# EAGLE design GimmeSoul (EAGLE 9.5.1)
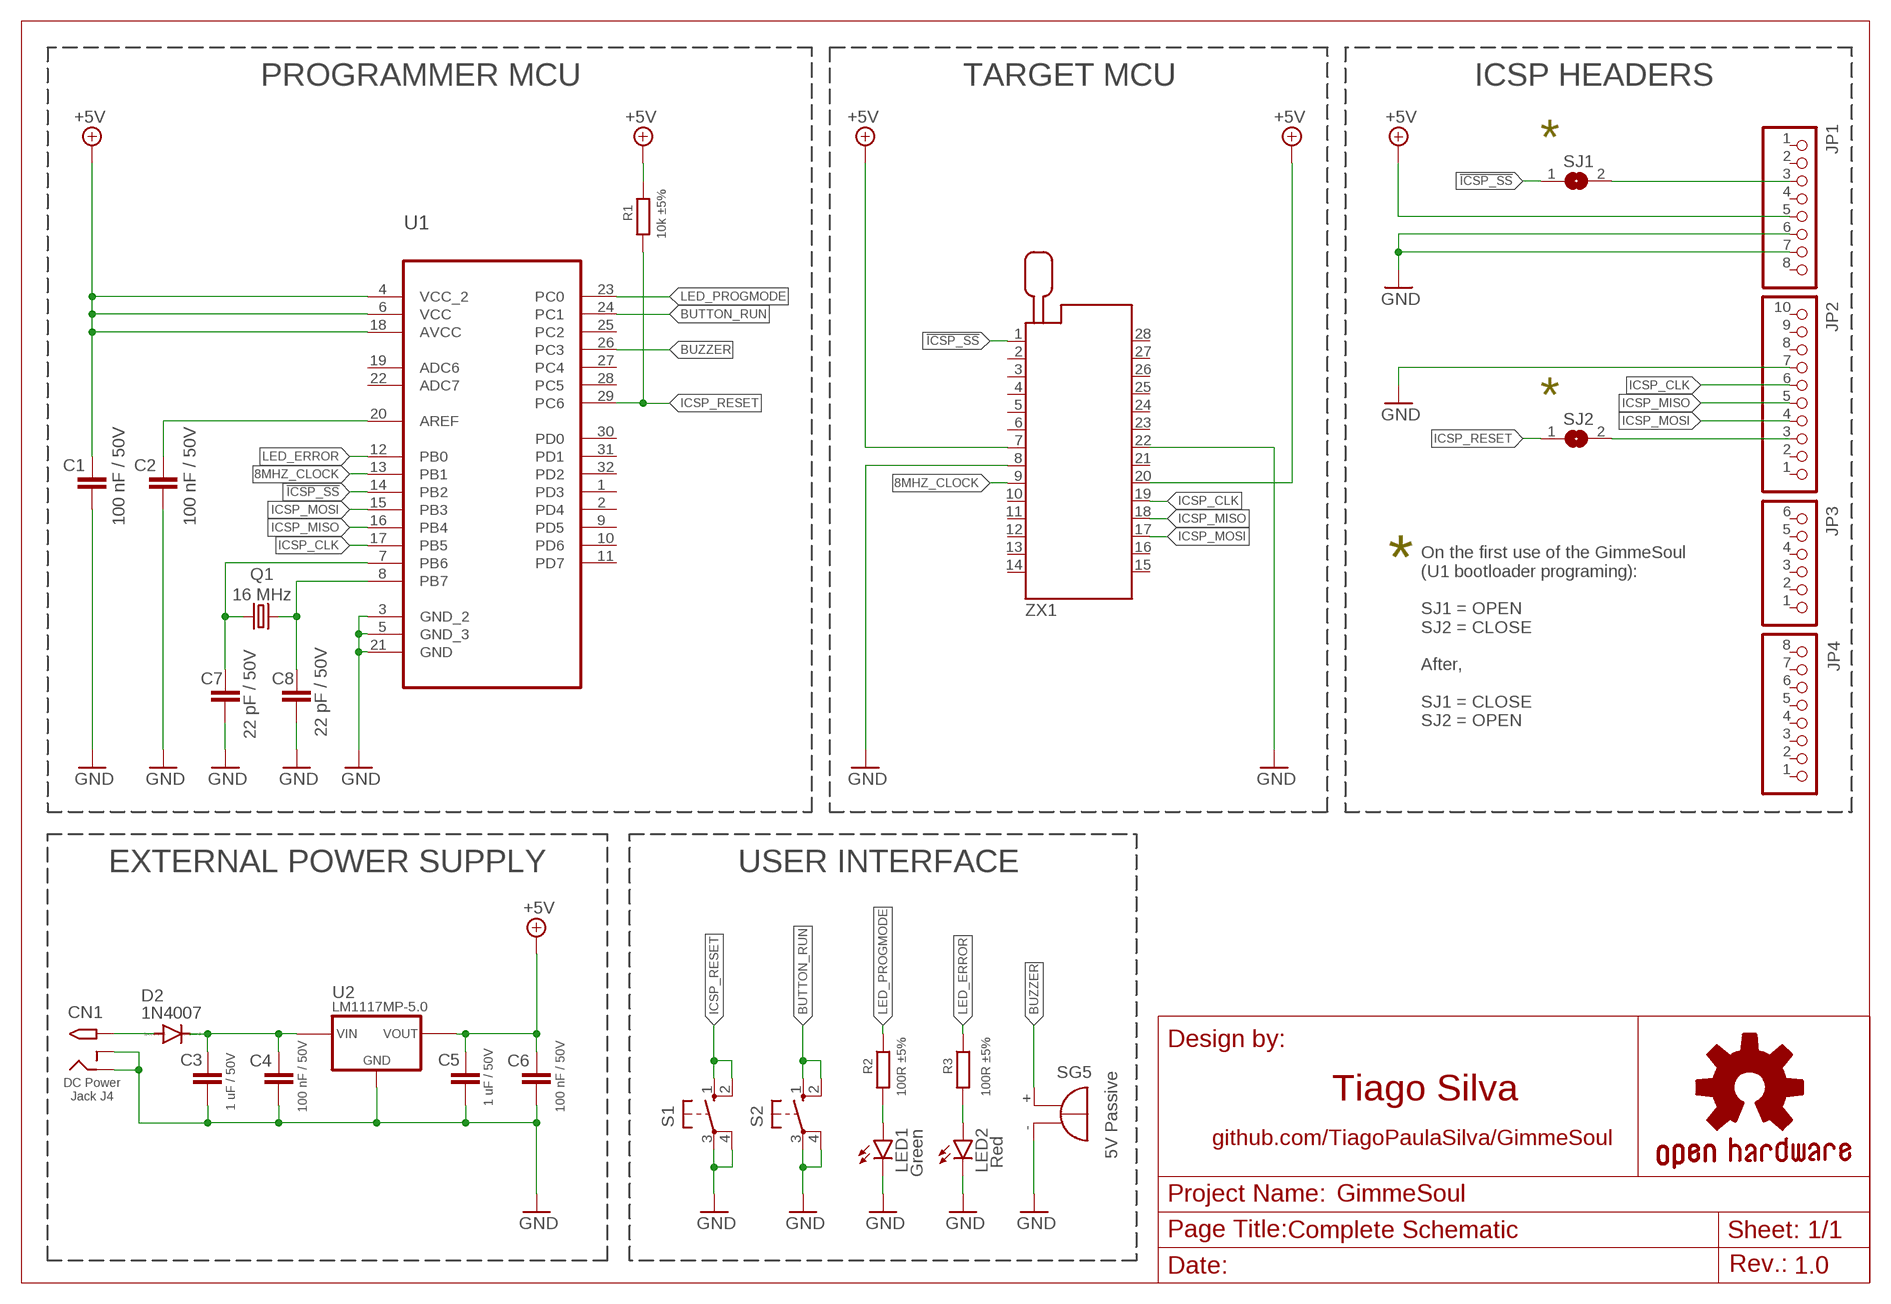
[diagram p0: schematic, sheet 1]

## Parts
C1  100 nF / 50V  C-EUC0805  [C0805]
C2  100 nF / 50V  C-EUC0805  [C0805]
C3  1 uF / 50V  C-EUC0805  [C0805]
C4  100 nF / 50V  C-EUC0805  [C0805]
C5  1 uF / 50V  C-EUC0805  [C0805]
C6  100 nF / 50V  C-EUC0805  [C0805]
C7  22 pF / 50V  C-EUC0805  [C0805]
C8  22 pF / 50V  C-EUC0805  [C0805]
CN1  2.1MMJACKTHM  [PJ-102A]
D2  1N4007  DIODE-SOD123  [SOD123]
JP1  PINHD-1X8  [1X08]
JP2  PINHD-1X10_ARD  [1X10]
JP3  PINHD-1X6  [1X06]
JP4  PINHD-1X8  [1X08]
LED1  Green  LED5MM  [LED5MM]
LED2  Red  LED5MM  [LED5MM]
Q1  16 MHz  CRYSTALHC49S  [HC49/S]
R1  10k ±5%  R-EU_R0805  [R0805]
R2  100R ±5%  R-EU_R0805  [R0805]
R3  100R ±5%  R-EU_R0805  [R0805]
S1  10-XX  [B3F-10XX]
S2  10-XX  [B3F-10XX]
SG5  5V Passive  F/QMBIII  [F/QMBIII]
SJ1  SJ  [SJ]
SJ2  SJ  [SJ]
U1  ATMEGA328P-AU  [QFP80P900X900X120-32N]
U2  LM1117MP-5.0  REG1117  [SOT223]
ZX1  228-4817-00-0602J  [228-4817-00-0602J]

## Nets
8MHZ_CLOCK: U1.13(PB1) ZX1.9
!ICSP_SS: SJ1.1 U1.14(PB2) ZX1.1
+5V: C1.2 C5.1 C6.1 JP1.5 R1.1 U1.4(VCC_2) U1.6(VCC) U1.18(AVCC) U2.2(VOUT) U2.4(VOUT) ZX1.7 ZX1.20
BUTTON_RUN: S2.1(S) S2.2(S1) U1.24(PC1)
BUZZER: SG5.+(-) U1.26(PC3)
GND [gnd]: C1.1 C2.1 C3.2 C4.2 C5.2 C6.2 C7.1 C8.1 CN1.RING CN1.RING_SW JP1.6 JP1.7 JP2.7 LED1.K(C) LED2.K(C) S1.3(P) S1.4(P1) S2.3(P) S2.4(P1) SG5.-(+) U1.3(GND_2) U1.5(GND_3) U1.21(GND) U2.1(GND) ZX1.8 ZX1.22
ICSP_CLK: JP2.6 U1.17(PB5) ZX1.19
ICSP_MISO: JP2.5 U1.16(PB4) ZX1.18
ICSP_MOSI: JP2.4 U1.15(PB3) ZX1.17
ICSP_RESET: R1.2 S1.1(S) S1.2(S1) SJ2.1 U1.29(PC6)
LED_ERROR: R3.1 U1.12(PB0)
LED_PROGMODE: R2.1 U1.23(PC0)
N$1: LED1.A R2.2
N$2: CN1.TIP D2.A
N$3: LED2.A R3.2
N$4: C3.1 C4.1 D2.C U2.3(VIN)
N$5: JP2.3 SJ2.2
N$6: JP1.3 SJ1.2
N$7: C7.2 Q1.1 U1.7(PB6)
N$8: C8.2 Q1.2 U1.8(PB7)
N$17: C2.2 U1.20(AREF)
Unconnected: JP1.1 JP1.2 JP1.4 JP1.8 JP2.1 JP2.2 JP2.8 JP2.9 JP2.10 JP3.1 JP3.2 JP3.3 JP3.4 JP3.5 JP3.6 JP4.1 JP4.2 JP4.3 JP4.4 JP4.5 JP4.6 JP4.7 JP4.8 U1.1(PD3) U1.2(PD4) U1.9(PD5) U1.10(PD6) U1.11(PD7) U1.19(ADC6) U1.22(ADC7) U1.25(PC2) U1.27(PC4) U1.28(PC5) U1.30(PD0) U1.31(PD1) U1.32(PD2) ZX1.2 ZX1.3 ZX1.4 ZX1.5 ZX1.6 ZX1.10 ZX1.11 ZX1.12 ZX1.13 ZX1.14 ZX1.15 ZX1.16 ZX1.21 ZX1.23 ZX1.24 ZX1.25 ZX1.26 ZX1.27 ZX1.28

## Notes on the sheet
- PROGRAMMER MCU | TARGET MCU | ICSP HEADERS
- *
- *
- *
- On the first use of the GimmeSoul
  (U1 bootloader programing):
  
  SJ1 = OPEN
  SJ2 = CLOSE
  
  After,
  
  SJ1 = CLOSE
  SJ2 = OPEN
- EXTERNAL POWER SUPPLY | USER INTERFACE
- DC Power
  Jack J4
- Tiago Silva
- github.com/TiagoPaulaSilva/GimmeSoul
- Complete Schematic
- 1.0

## Library data of the parts
C1-C8 = rcl:C-EU: CAPACITOR, European symbol; SPICEPREFIX: C
CN1 = adafruit:2.1MMJACK: 2.1mm x 5.5mm THM DC jack with internal switch. Digikey part #PJ-102A, 4UCON part #05537 2.1mm x 5.5mm SMT DC jack with internal switch. Digikey part #PJ-002A-SMT, 4UCON part #03267 By microbuilder.eu & adafruit.com
D2 = diode:DIODE-: DIODE
JP1 JP4 = SmartPrj:PINHD-1X8: PIN HEADER
JP2 = SmartPrj:PINHD-1X10_ARD: PIN HEADER
JP3 = SmartPrj:PINHD-1X6: PIN HEADER
LED1 LED2 = led:LED: LED OSRAM: - CHIPLED LG R971, LG N971, LY N971, LG Q971, LY Q971, LO R971, LY R971 LH N974, LH R974 LS Q976, LO Q976, LY Q976 LO Q996 - Hyper CHIPLED LW Q18S LB Q993, LB Q99A, LB R99A - SideLED LS A670, LO A670, LY A670, LG A670, LP A670 LB A673, LV A673, LT A673, LW A673 LH A674 LY A675 LS A676, LA A676, LO A676, LY A676, LW A676 LS A679, LY A679, LG A679 - Hyper Micro SIDELED® LS Y876, LA Y876, LO Y876, LY Y876 LT Y87S - SmartLED LW L88C, LW L88S LB L89C, LB L89S, LG L890 LS L89K, LO L89K, LY L89K LS L896, LA L896, LO L896, LY L896 - TOPLED LS T670, LO T670, LY T670, LG T670, LP T670 LSG T670, LSP T670, LSY T670, LOP T670, LYG T670 LG T671, LOG T671, LSG T671 LB T673, LV T673, LT T673, LW T673 LH T674 LS T676, LA T676, LO T676, LY T676, LB T676, LH T676, LSB T676, LW T676 LB T67C, LV T67C, LT T67C, LS T67K, LO T67K, LY T67K, LW E67C LS E67B, LA E67B, LO E67B, LY E67B, LB E67C, LV E67C, LT E67C LW T67C LS T679, LY T679, LG T679 LS T770, LO T770, LY T770, LG T770, LP T770 LB T773, LV T773, LT T773, LW T773 LH T774 LS E675, LA E675, LY E675, LS T675 LS T776, LA T776, LO T776, LY T776, LB T776 LHGB T686 LT T68C, LB T68C - Hyper Mini TOPLED® LB M676 - Mini TOPLED Santana® LG M470 LS M47K, LO M47K, LY M47K Source: http://www.osram.convergy.de LUXEON: - LUMILED® LXK2-PW12-R00, LXK2-PW12-S00, LXK2-PW14-U00, LXK2-PW14-V00 LXK2-PM12-R00, LXK2-PM12-S00, LXK2-PM14-U00 LXK2-PE12-Q00, LXK2-PE12-R00, LXK2-PE12-S00, LXK2-PE14-T00, LXK2-PE14-U00 LXK2-PB12-K00, LXK2-PB12-L00, LXK2-PB12-M00, LXK2-PB14-N00, LXK2-PB14-P00, LXK2-PB14-Q00 LXK2-PR12-L00, LXK2-PR12-M00, LXK2-PR14-Q00, LXK2-PR14-R00 LXK2-PD12-Q00, LXK2-PD12-R00, LXK2-PD12-S00 LXK2-PH12-R00, LXK2-PH12-S00 LXK2-PL12-P00, LXK2-PL12-Q00, LXK2-PL12-R00 Source: www.luxeon.com KINGBRIGHT: KA-3528ASYC Source: www.kingbright.com
Q1 = crystal:CRYSTAL: CRYSTAL; OC_FARNELL: 1667008; OC_NEWARK: unknown
R1-R3 = rcl:R-EU_: RESISTOR, European symbol; SPICEPREFIX: R
S1 S2 = switch-omron:10-XX: OMRON SWITCH; MPN: B3F-1000; OC_FARNELL: 176432; OC_NEWARK: 36M3542
SG5 = buzzer:F/QMBIII: BUZZER Source: Buerklin; OC_FARNELL: unknown; OC_NEWARK: unknown
SJ1 SJ2 = jumper:SJ: SMD solder JUMPER
U1 = Atmel_By_element14_Batch_1-00:ATMEGA328P-AU: 8-bit Microcontroller with In-System Programmable Flash; MPN: ATMEGA328P-AU; OC_FARNELL: 1715486; OC_NEWARK: 14R4631; PACKAGE: TQFP-32; SUPPLIER: Atmel
U2 = REG1117:REG1117: 800mA and 1A Low Dropout (LDO) Positive Regulator 1.8V, 2.5V, 2.85V, 3.3V, 5V, and Adj; AVAILABILITY: Unavailable; DESCRIPTION: LDO Regulator Pos 1.25V to 13.5V 0.8A 4-Pin_3+Tab_ SOT-223 Tube; MF: Texas Instruments; MP: REG1117; PACKAGE: SOT-223-4 Texas Instruments; PRICE: None
ZX1 = con-3m:228-?00-0602J: Zero Insertion Force Socked Source: http://www.3M.com/ehpd; MF: 3M; MPN: 228-4817-00-0602J; OC_FARNELL: 1252775; OC_NEWARK: 85K7834

## Net classes
0 default: width 0.254 mm, clearance 0.254 mm
2 gnd: width 0.305 mm, drill 0.559 mm, clearance 0.254 mm

## Board
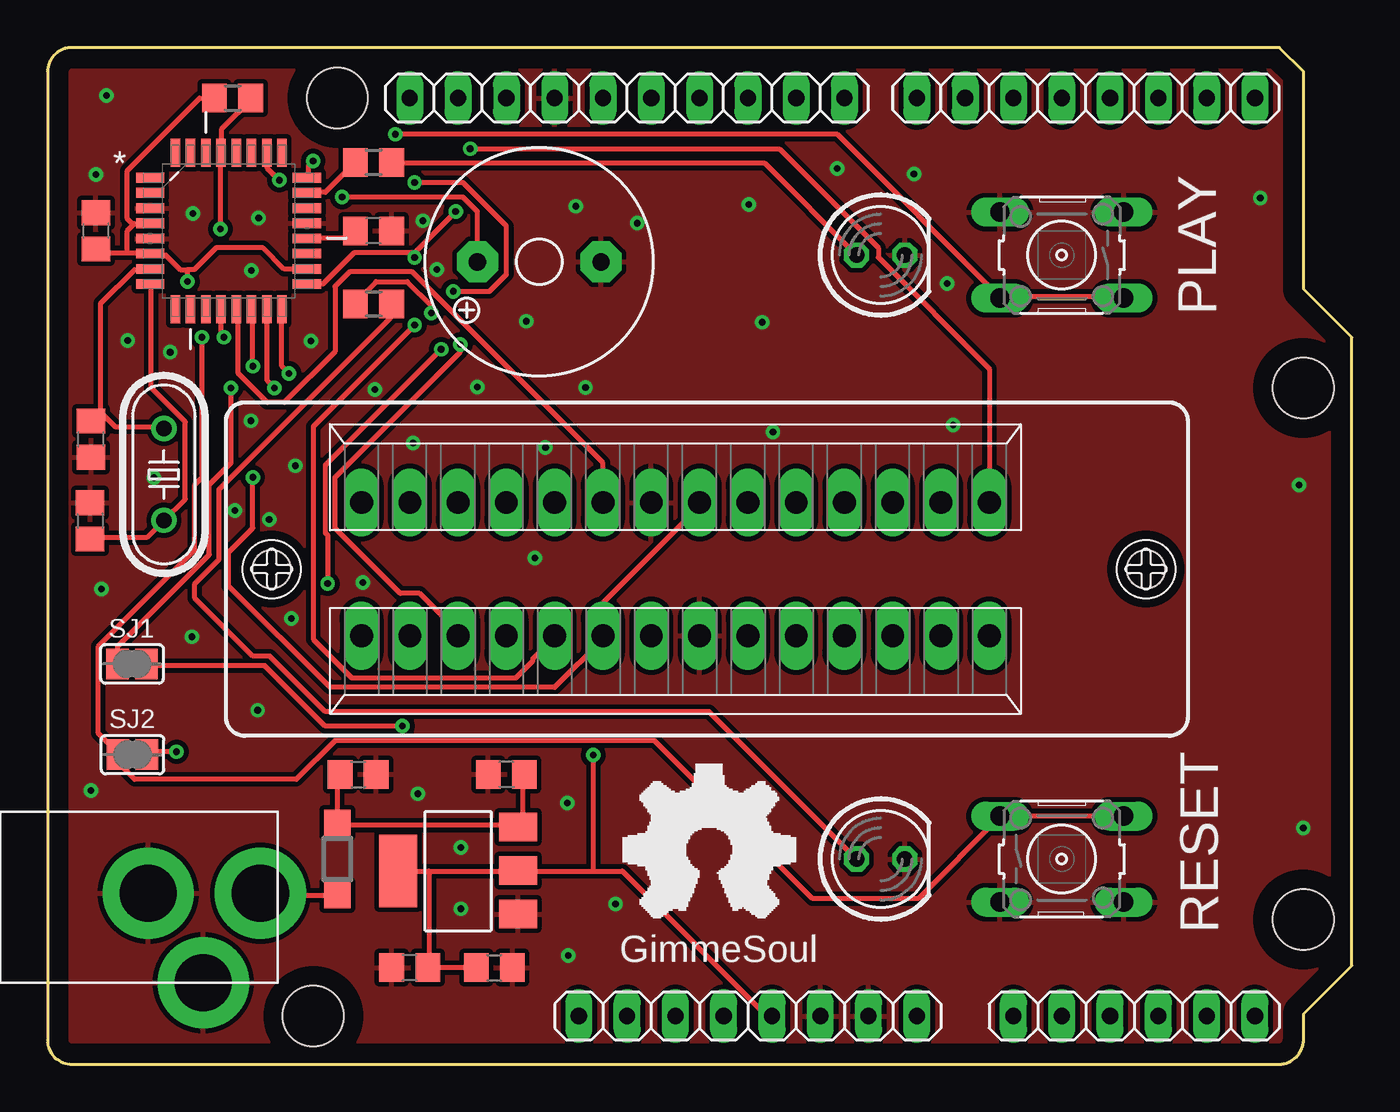
[diagram p1: board, top side]
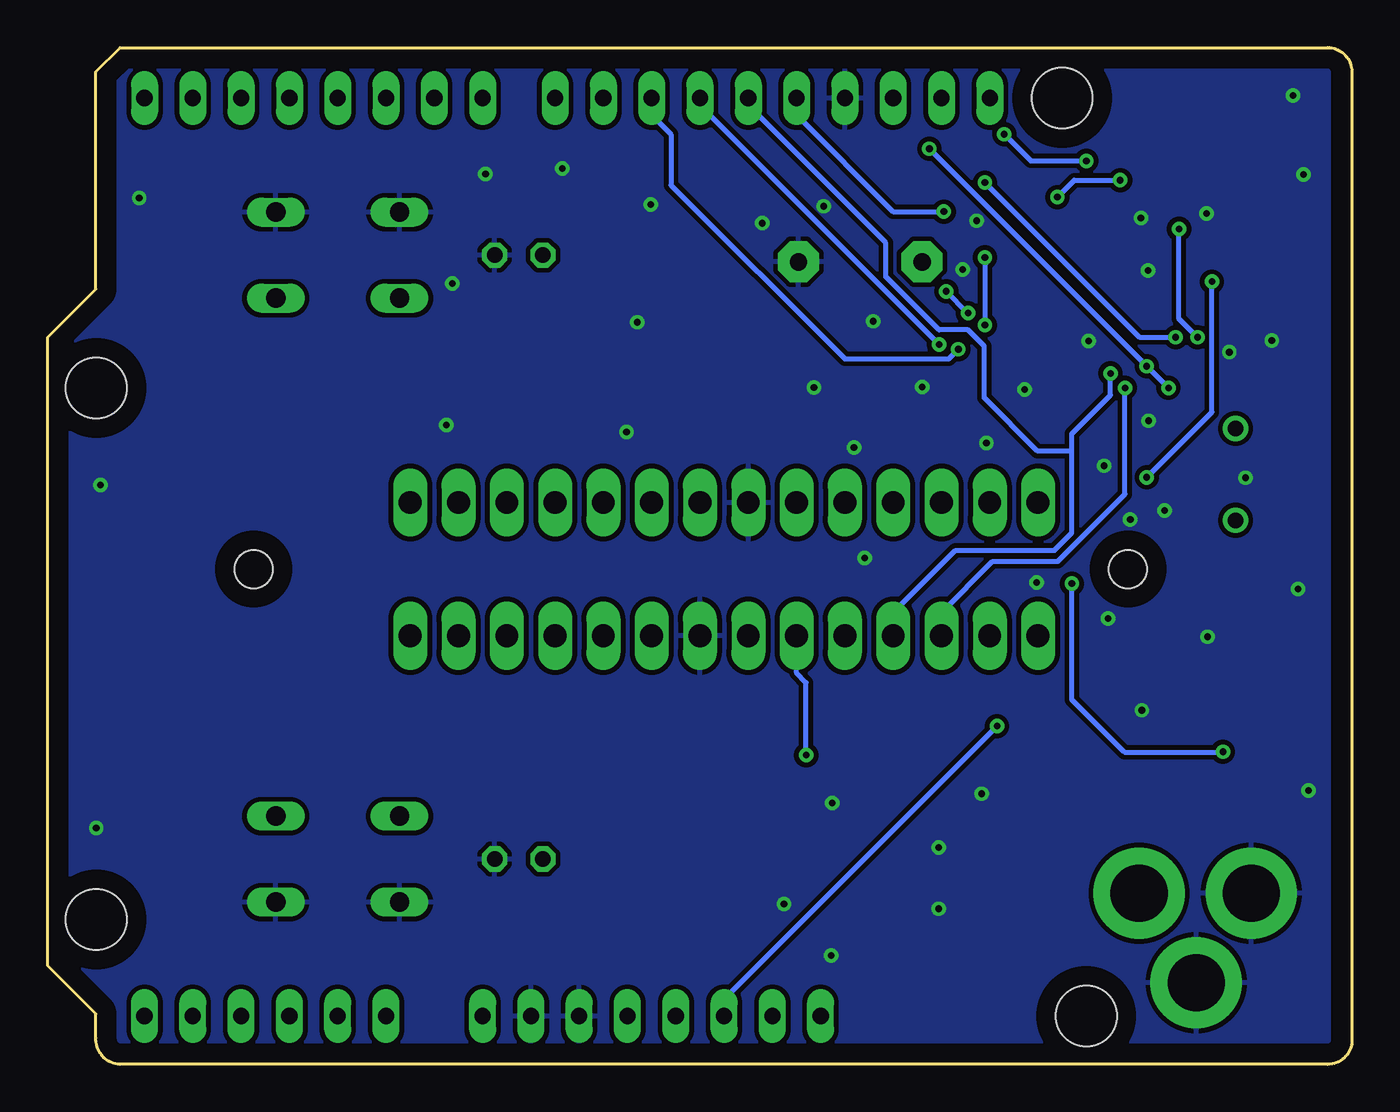
[diagram p2: board, bottom side, seen from below]

Size 68.6 x 53.45 mm. Coordinates in mm from the lower left corner, seen from the top.
Outline: 0,52.19 0,1.27 arc90 1.27,0 64.79,0 arc90 66.06,1.39 66.06,2.65 68.6,5.2 68.6,38.22 66.06,40.76 66.06,52.19 64.79,53.45 1.29,53.45 arc90 0,52.19
Copper layers (1*16): Top 0.035mm / dielectric 1.5mm / Bottom 0.035mm
Design rules "default *": minimum track width 6mil, minimum drill 0.3mm, track to track 10mil, track to pad 10mil, pad to pad 10mil, via to via 10mil, smd to smd 10mil, copper to edge 40mil, drill to drill 6mil, minimum pad ring 10mil, minimum via ring 8mil, stop-mask expansion 4mil, vias tented up to drill 0mil, thermal gap 10mil
Holes 3.2 mm at 66.04,7.62 66.04,35.56 15.24,50.8 13.97,2.54

### Footprints (pad centres in the part's own frame; a part is rotated, then mirrored left to right if it is on the bottom)
C0805 = smd 1.3 x 1.5: 1 -0.95,0; 2 0.95,0
PJ-102A = drill 3 pad 4.8: RING 0.1,-3.39; RING_SW -4.6,-6.29; TIP 0.1,-9.29
SOD123 = smd 1.4 x 1.4: A 1.9,0; C -1.9,0
1X08 = drill 0.85 pad 1.422 long: 1 -8.89,0; 2 -6.35,0; 3 -3.81,0; 4 -1.27,0; 5 1.27,0; 6 3.81,0; 7 6.35,0; 8 8.89,0
1X10 = drill 0.85 pad 1.422 long: 1 -11.43,0; 2 -8.89,0; 3 -6.35,0; 4 -3.81,0; 5 -1.27,0; 6 1.27,0; 7 3.81,0; 8 6.35,0; 9 8.89,0; 10 11.43,0
1X06 = drill 0.85 pad 1.422 long: 1 -6.35,0; 2 -3.81,0; 3 -1.27,0; 4 1.27,0; 5 3.81,0; 6 6.35,0
LED5MM = drill 0.813 octagon: A -1.27,0; K 1.27,0
HC49/S = drill 0.813: 1 -2.413,0; 2 2.413,0
R0805 = smd 1.3 x 1.5: 1 -0.95,0; 2 0.95,0
B3F-10XX = drill 1.016 long: 1 -3.251,2.261; 2 3.251,2.261; 3 -3.251,-2.261; 4 3.251,-2.261
F/QMBIII = drill 0.914 pad 2.159 octagon: + 3.251,0; - -3.251,0
SJ = smd 1.168 x 1.6: 1 -0.762,0; 2 0.762,0
QFP80P900X900X120-32N = smd 1.473 x 0.508: 1 -4.115,2.794; 2 -4.115,2.007; 3 -4.115,1.194; 4 -4.115,0.406; 5 -4.115,-0.406; 6 -4.115,-1.194; 7 -4.115,-2.007; 8 -4.115,-2.794; 17 4.115,-2.794; 18 4.115,-2.007; 19 4.115,-1.194; 20 4.115,-0.406; 21 4.115,0.406; 22 4.115,1.194; 23 4.115,2.007; 24 4.115,2.794 | smd 0.508 x 1.473: 9 -2.794,-4.115; 10 -2.007,-4.115; 11 -1.194,-4.115; 12 -0.406,-4.115; 13 0.406,-4.115; 14 1.194,-4.115; 15 2.007,-4.115; 16 2.794,-4.115; 25 2.794,4.115; 26 2.007,4.115; 27 1.194,4.115; 28 0.406,4.115; 29 -0.406,4.115; 30 -1.194,4.115; 31 -2.007,4.115; 32 -2.794,4.115
SOT223 = smd 1.499 x 2.007: 1 -2.261,-3.15; 2 0.025,-3.15; 3 2.311,-3.15 | smd 3.81 x 2.007: 4 0,3.15
228-4817-00-0602J = drill 1.2 long: 1 -16.51,-3.5; 2 -13.97,-3.5; 3 -11.43,-3.5; 4 -8.89,-3.5; 5 -6.35,-3.5; 6 -3.81,-3.5; 7 -1.27,-3.5; 8 1.27,-3.5; 9 3.81,-3.5; 10 6.35,-3.5; 11 8.89,-3.5; 12 11.43,-3.5; 13 13.97,-3.5; 14 16.51,-3.5; 15 16.51,3.5; 16 13.97,3.5; 17 11.43,3.5; 18 8.89,3.5; 19 6.35,3.5; 20 3.81,3.5; 21 1.27,3.5; 22 -1.27,3.5; 23 -3.81,3.5; 24 -6.35,3.5; 25 -8.89,3.5; 26 -11.43,3.5; 27 -13.97,3.5; 28 -16.51,3.5 | hole 2: 21.24,0; -24.74,0

### Placement (x,y rotation side)
C1  2.54,43.81 270 top
C2  17.14,43.81 180 top
C3  16.33,15.24 0 top
C4  24.13,15.24 180 top
C5  23.5,5.08 0 top
C6  19.05,5.08 180 top
C7  2.29,32.87 90 top
C8  2.24,28.57 270 top
CN1  1.91,8.89 90 top
D2  15.24,10.79 270 top
JP1  36.83,2.54 0 top
JP2  30.48,50.8 180 top
JP3  57.15,2.54 0 top
JP4  54.61,50.8 180 top
LED1  43.81,42.55 0 top
LED2  43.81,10.79 0 top
Q1  6.12,31.01 270 top
R1  9.73,50.8 0 top
R2  17.14,47.42 0 top
R3  17.14,39.98 0 top
S1  53.34,10.79 0 top
S2  53.34,42.55 180 top
SG5  25.86,42.19 180 top
SJ1  4.45,21.06 0 top
SJ2  4.47,16.28 0 top
U1  9.53,43.81 0 top
U2  21.59,10.16 90 top
ZX1  33.02,26.04 180 top

### Tracks (layer width: path | path; a pad name or v marks a point on that pad's centre or on a via)
8MHZ_CLOCK
  Top 0.254: ZX1.9 29.21,31.62 19.18,41.66 15.88,41.66 15.11,40.89 15.11,37.47 12.45,34.8 11.56,34.8 10.03,36.32 10.03,39.62 U1.13
!ICSP_SS  (via drill 0.35)
  Top 0.254: v10.79,36.7 10.79,39.62 U1.14 | v9.65,35.56 9.65,31.62 8.51,30.48 8.51,26.8 3.68,21.97 SJ1.1 | ZX1.1 49.53,36.58 43.69,42.42 43.69,42.93 38.48,48.13 v22.23,48.13
  Bottom 0.254: v9.65,35.56 v10.79,36.7 v22.23,48.13
+5V  (via drill 0.35)
  Top 0.254: 4.19,42.67 2.67,42.67 2.54,42.8 C1.2 | 4.19,42.67 5.33,42.67 U1.6 5.46,42.55 6.22,42.55 6.99,41.78 7.37,41.78 | 4.51,44.13 4.19,43.81 4.19,42.67 | 4.51,44.13 4.57,44.2 5.33,44.2 U1.4 | 7.37,41.78 7.72,41.78 8.87,42.93 11.33,42.93 12.45,41.81 U1.18 | R1.1 8,50.8 4.19,46.99 4.19,44.45 4.51,44.13 | ZX1.7 34.29,29.34 29.21,24.26 ZX1.20 29.21,22.35 26.67,19.81 14.86,19.81 9.53,25.15 9.53,26.92 10.79,28.19 v10.79,30.86 | C5.1 20.07,5.08 | U2.4 20.07,10.16 | 20.07,10.16 24.64,10.16 U2.2 24.77,10.16 28.7,10.16 | 20.07,10.16 20.07,5.08 | 20.07,5.08 C6.1 | JP1.5 37.85,2.54 30.23,10.16 28.7,10.16 | 28.7,10.16 v28.7,16.26 | v7.37,41.15 7.37,41.78
  Bottom 0.254: ZX1.20 29.21,20.57 28.7,20.07 v28.7,16.26 | v7.37,41.15 7.37,34.29 v10.79,30.86
BUTTON_RUN  (via drill 0.35)
  Top 0.254: v13.97,47.5 13.72,47.24 13.72,46.61 U1.24 | v18.29,48.9 41.53,48.9 50.04,40.39 S2.2 50.16,40.39 56.52,40.39 S2.1
  Bottom 0.254: v13.97,47.5 16.89,47.5 v18.29,48.9
BUZZER  (via drill 0.35)
  Top 0.254: v12.19,46.48 11.56,47.12 11.56,47.88 U1.26 | v15.49,45.59 21.84,45.59 22.61,44.83 SG5.+
  Bottom 0.254: v12.19,46.48 14.61,46.48 v15.49,45.59
GND  (via drill 0.35)
  other vias: 2.54,46.79 7.65,44.73 11.1,44.5 13.84,38.02 22.61,35.61 19.23,32.66 26.19,32.44 25.17,39.07 28.3,35.59 36.88,45.21 47.62,33.6 38.15,33.25 41.53,47.09 47.32,41.05 45.57,46.81 31.01,44.22 20.47,41.78 19.74,44.35 21.74,8.18 21.74,11.4 29.87,8.43 27.38,5.71 27.33,13.74 19.48,14.22 11.05,18.62 2.29,14.4 2.84,24.99 5.59,30.84 4.22,38.05 6.45,37.44 10.69,33.83 13.03,31.47 11.66,28.65 25.63,26.62 37.59,39.01 3.1,50.93 65.81,30.45 63.78,45.54 66.04,12.42 27.79,45.11 7.59,22.48 16.59,25.32 17.22,35.48 10.72,41.73 9.86,29.11 12.83,23.44
  pour Top: 0,0 65.41,0 66.04,0.64 66.04,2.54 68.58,5.08 68.58,38.1 66.04,40.64 66.04,52.07 64.77,53.34 0.64,53.34 0,52.7
  pour Bottom: 0,0 65.41,0 66.04,0.64 66.04,2.54 68.58,5.08 68.58,38.1 66.04,40.64 66.04,52.07 64.77,53.34 0.64,53.34 0,52.7
ICSP_CLK  (via drill 0.35)
  Top 0.254: U1.17 14.48,41.02 16.13,42.67 19.3,42.67 | v21.46,44.83 19.3,42.67 | v19.3,38.86 13.97,33.53 13.97,22.35 16,20.32 24.64,20.32 25.53,21.21 25.53,21.34 26.67,22.48 ZX1.19 | 19.3,42.67 v19.3,42.42
  Bottom 0.254: v21.46,44.83 24.13,44.83 29.21,49.91 JP2.6 | v19.3,42.42 v19.3,38.86
ICSP_MISO  (via drill 0.35)
  Top 0.254: U1.16 12.32,36.7 v12.7,36.32
  Bottom 0.254: v12.7,36.32 12.7,35.18 14.73,33.15 14.73,32.23 | 14.73,32.23 14.73,27.94 15.65,27.03 20.85,27.03 24.13,23.75 ZX1.18 | JP2.5 31.75,50.42 24.51,43.18 24.51,41.4 21.72,38.61 20.19,38.61 19.34,37.76 19.34,35.04 16.54,32.23 14.73,32.23
ICSP_MOSI  (via drill 0.35)
  Top 0.254: v11.94,35.56 11.56,35.94 11.56,39.62 U1.15 | v21.72,37.85 21.72,37.47 15.11,30.86 15.11,28.19 18.54,24.77 19.56,24.77 21.59,22.73 ZX1.17
  Bottom 0.254: v11.94,35.56 11.94,29.97 15.47,26.44 18.9,26.44 21.59,23.75 ZX1.17 | JP2.4 34.29,50.42 v21.72,37.85
ICSP_RESET  (via drill 0.35)
  Top 0.254: R1.2 10.79,50.8 9.14,49.15 9.14,48.01 U1.29 9.09,47.92 v9.09,43.92 | v8.13,38.23 8.13,30.86 7.75,30.48 7.75,27.05 2.67,21.97 2.67,17.4 3.68,16.38 SJ2.1 3.81,16.26 3.81,15.75 4.57,14.99 13.08,14.99 15.11,17.02 31.93,17.02 40.23,8.71 45.8,8.71 50.04,12.95 S1.1 50.16,13.08 56.52,13.08 S1.2
  Bottom 0.254: v9.09,43.92 9.09,39.19 v8.13,38.23
LED_ERROR  (via drill 0.35)
  Top 0.254: v9.27,38.23 9.14,38.35 9.14,39.62 U1.12 | v19.3,46.35 21.84,46.35 24.13,44.07 24.13,41.53 23.24,40.64 v21.34,40.64 | v20.19,39.5 20.19,39.88 18.92,41.15 17.27,41.15 16.13,40.01 R3.1
  Bottom 0.254: v9.27,38.23 11.18,38.23 v19.3,46.35 | v20.19,39.5 v21.34,40.64
LED_PROGMODE
  Top 0.254: U1.23 13.72,45.85 14.61,45.85 16.13,47.37 R2.1
N$1
  Top 0.254: LED1.A 37.72,47.37 18.16,47.37 R2.2
N$2
  Top 0.254: D2.A 11.3,8.89 CN1.TIP
N$3
  Top 0.254: LED2.A 34.8,18.54 14.61,18.54 11.68,21.46 10.79,21.46 7.75,24.51 7.75,25.27 9.02,26.54 9.02,30.23 18.03,39.24 18.03,39.88 R3.2
N$4
  Top 0.254: C3.1 15.37,15.24 15.24,15.11 D2.C 15.24,12.57 24.64,12.57 U2.3 24.77,12.57 25.02,12.83 25.02,15.24 C4.1
N$5  (via drill 0.35)
  Top 0.254: v6.78,16.43 5.21,16.43 5.21,16.38 SJ2.2 | v14.73,25.27 14.73,27.81 14.61,27.94 14.61,31.5 v20.7,37.59
  Bottom 0.254: v20.7,37.59 21.21,37.08 26.67,37.08 35.81,46.23 35.81,48.9 36.83,49.91 JP2.3 | v6.78,16.43 6.81,16.41 11.96,16.41 14.73,19.18 v14.73,25.27
N$6  (via drill 0.35)
  Top 0.254: v18.67,17.78 14.61,17.78 11.43,20.95 5.21,20.95 SJ1.2
  Bottom 0.254: v18.67,17.78 33.02,3.43 JP1.3
N$7
  Top 0.254: U1.7 5.33,41.78 4.57,41.78 2.79,40.01 2.79,34.42 2.29,33.91 C7.2 2.79,34.29 3.56,33.53 6.1,33.53 Q1.1
N$8
  Top 0.254: U1.8 5.46,41.02 5.46,35.56 7.24,33.78 7.24,29.72 Q1.2 5.21,27.69 2.29,27.69 C8.2
N$17
  Top 0.254: U1.20 13.72,43.43 15.75,43.43 16.13,43.81 C2.2

### Text on the board
tPlace: PLAY | RESET | GimmeSoul